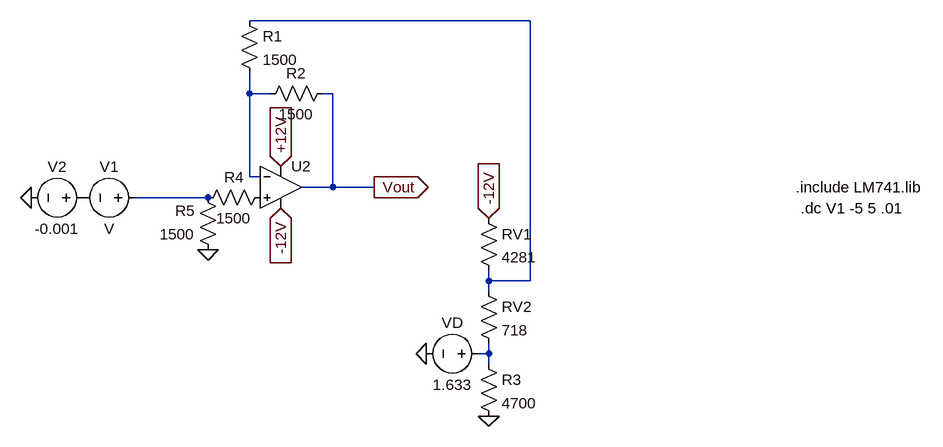
[diagram p0: schematic U2.asc]
U2.asc, the LTspice schematic file:
Version 4
SHEET 1 880 680
WIRE 64 -144 -368 -144
WIRE -368 -32 -368 -64
WIRE -336 -32 -368 -32
WIRE -240 -32 -256 -32
WIRE -368 96 -368 -32
WIRE -352 96 -368 96
WIRE -240 112 -240 -32
WIRE -240 112 -288 112
WIRE -176 112 -240 112
WIRE -432 128 -544 128
WIRE 0 256 0 240
WIRE 64 256 64 -144
WIRE 64 256 0 256
WIRE 0 272 0 256
WIRE 0 368 0 352
WIRE 0 368 -16 368
WIRE 0 384 0 368
FLAG -176 112 Vout
IOPIN -176 112 Out
FLAG -320 80 +12V
IOPIN -320 80 In
FLAG -320 144 -12V
IOPIN -320 144 In
FLAG 0 464 0
FLAG 0 160 -12V
IOPIN 0 160 In
FLAG -96 368 0
FLAG -432 208 0
FLAG -704 128 0
SYMBOL OpAmps\\UniversalOpAmp2 -320 112 R0
SYMATTR InstName U2
SYMBOL res -384 -160 R0
SYMATTR InstName R1
SYMATTR Value 1500
SYMBOL res -240 -48 R90
WINDOW 0 0 56 VBottom 2
WINDOW 3 32 56 VTop 2
SYMATTR InstName R2
SYMATTR Value 1500
SYMBOL res -16 144 R0
SYMATTR InstName RV1
SYMATTR Value 4281
SYMBOL res -16 256 R0
SYMATTR InstName RV2
SYMATTR Value 718
SYMBOL res -16 368 R0
SYMATTR InstName R3
SYMATTR Value 4700
SYMBOL voltage 0 368 R90
WINDOW 0 -32 56 VBottom 2
WINDOW 3 32 56 VTop 2
SYMATTR InstName VD
SYMATTR Value 1.633
SYMBOL res -448 144 R270
WINDOW 0 32 56 VTop 2
WINDOW 3 0 56 VBottom 2
SYMATTR InstName R4
SYMATTR Value 1500
SYMBOL res -416 224 R180
WINDOW 0 36 76 Left 2
WINDOW 3 36 40 Left 2
SYMATTR InstName R5
SYMATTR Value 1500
SYMBOL voltage -528 128 R90
WINDOW 0 -32 56 VBottom 2
WINDOW 3 32 56 VTop 2
SYMATTR InstName V1
SYMBOL voltage -608 128 R90
WINDOW 0 -32 56 VBottom 2
WINDOW 3 32 56 VTop 2
SYMATTR InstName V2
SYMATTR Value -0.001
TEXT 472 112 Left 2 !.include LM741.lib
TEXT 480 144 Left 2 !.dc V1 -5 5 .01

The netlist it stands for:
* U2.asc
XU2 P001 N002 +12V -12V Vout level2 Avol=1Meg GBW=10Meg Slew=10Meg Ilimit=25m Rail=0 Vos=0 En=0 Enk=0 In=0 Ink=0 Rin=500Meg  ; pins In+ In- V+ V- OUT
R1 N001 N002 1500
R2 Vout N002 1500
RV1 -12V N001 4281
RV2 N001 N004 718
R3 N004 0 4700
VD N004 0 1.633
R4 N003 P001 1500
R5 0 N003 1500
V1 N003 P002 V
V2 P002 0 -0.001
.include LM741.lib
.dc V1 -5 5 .01
.lib UniversalOpAmp2.lib
.backanno
.end